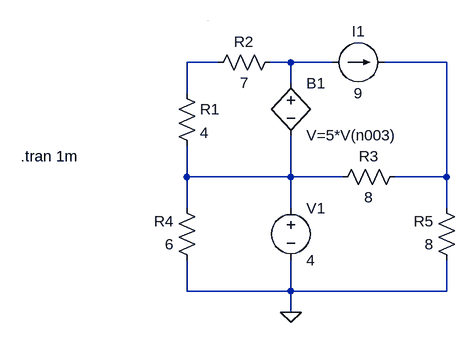
[diagram p0: schematic Q8 att 2.asc]
Q8 att 2.asc, the LTspice schematic file:
Version 4.1
SHEET 1 880 680
WIRE 16 64 -32 64
WIRE 128 64 96 64
WIRE 192 64 128 64
WIRE 368 64 272 64
WIRE 128 96 128 64
WIRE -32 112 -32 64
WIRE -32 240 -32 192
WIRE 128 240 128 176
WIRE 128 240 -32 240
WIRE 208 240 128 240
WIRE 368 240 368 64
WIRE 368 240 288 240
WIRE -32 288 -32 240
WIRE 128 288 128 240
WIRE 368 288 368 240
WIRE -32 416 -32 368
WIRE 128 416 128 368
WIRE 128 416 -32 416
WIRE 368 416 368 368
WIRE 368 416 128 416
WIRE 128 448 128 416
WIRE 0 0 0 0
FLAG 128 448 0
SYMBOL res -48 96 R0
SYMATTR InstName R1
SYMATTR Value 4
SYMBOL res 112 48 R90
WINDOW 0 0 56 VBottom 2
WINDOW 3 32 56 VTop 2
SYMATTR InstName R2
SYMATTR Value 7
SYMBOL res 304 224 R90
WINDOW 0 0 56 VBottom 2
WINDOW 3 32 56 VTop 2
SYMATTR InstName R3
SYMATTR Value 8
SYMBOL res -16 384 R180
WINDOW 0 36 76 Left 2
WINDOW 3 36 40 Left 2
SYMATTR InstName R4
SYMATTR Value 6
SYMBOL res 384 384 R180
WINDOW 0 36 76 Left 2
WINDOW 3 36 40 Left 2
SYMATTR InstName R5
SYMATTR Value 8
SYMBOL voltage 128 272 R0
WINDOW 123 0 0 Left 0
WINDOW 39 0 0 Left 0
SYMATTR InstName V1
SYMATTR Value 4
SYMBOL current 192 64 R270
WINDOW 0 32 40 VTop 2
WINDOW 3 -32 40 VBottom 2
WINDOW 123 0 0 Left 0
WINDOW 39 0 0 Left 0
SYMATTR InstName I1
SYMATTR Value 9
SYMBOL bv 128 80 R0
SYMATTR InstName B1
SYMATTR Value V=5*V(n003)
TEXT -288 208 Left 2 !.tran 1m

The netlist it stands for:
* Q8 att 2.asc
R1 N001 N004 4
R2 N002 N001 7
R3 N003 N004 8
R4 0 N004 6
R5 0 N003 8
V1 N004 0 4
I1 N002 N003 9
B1 N002 N004 V=5*V(n003)
.tran 1m
.backanno
.end